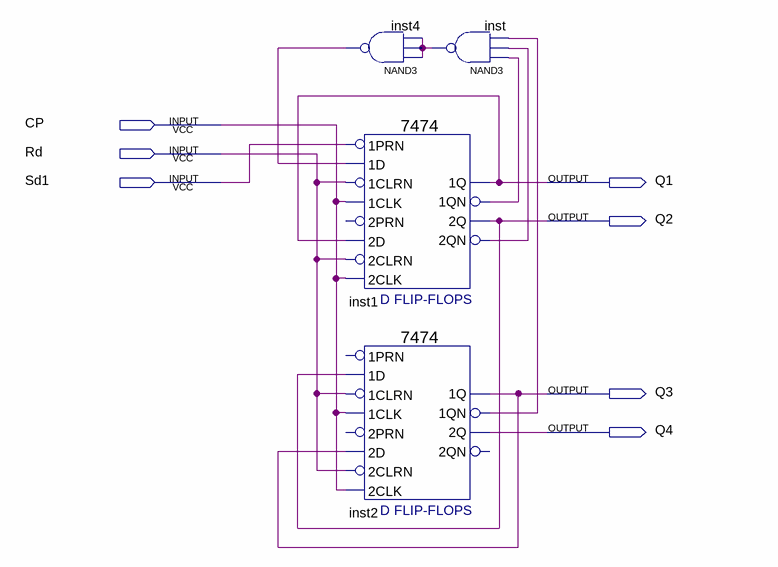
[diagram p0: schematic sheet]
// Quartus schematic pj703_2.bdf as structural Verilog: 4 symbols, 7 pins
module pj703_2 (
  input  CP,
  input  Rd,
  input  Sd1,
  output Q1,
  output Q2,
  output Q3,
  output Q4
);

  wire inst1_1qn, inst1_2qn, inst2_1qn, inst4_out, inst_out;

  nand inst4 (inst4_out, inst_out, inst_out, inst_out);
  \7474  inst1 (
    .\2D (Q1), .\1CLK (CP), .\1D (inst4_out), .\1PRN (Sd1), .\2CLK (CP), .\2CLRN (Rd), .\1CLRN (Rd),
    .\1QN (inst1_1qn), .\2Q (Q2), .\2QN (inst1_2qn), .\1Q (Q1));  // open: 2PRN
  \7474  inst2 (
    .\2D (Q3), .\1CLK (CP), .\1D (Q2), .\2CLK (CP), .\2CLRN (Rd), .\1CLRN (Rd), .\1QN (inst2_1qn), .\2Q (Q4),
    .\1Q (Q3));  // open: 2PRN, 1PRN, 2QN
  nand inst (inst_out, inst1_1qn, inst1_2qn, inst2_1qn);
endmodule
